# Altium schematic sheet Connectors.SchDoc
size A; SheetNumber: 4; SheetTotal: 4
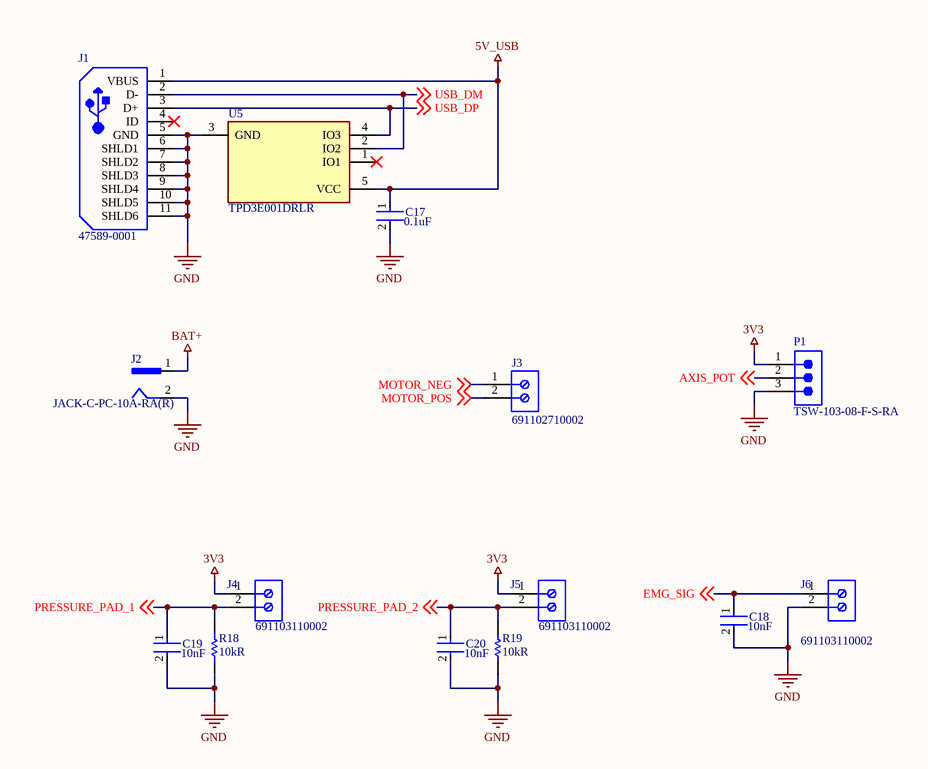
[diagram p0: Connectors.SchDoc]

## Parts
C17  Capacitance: 0.1uF  [FP-GCD21B-0_15-IPC_B]  (hidden comment: GCD21BR71H104MA01L)
C18  Capacitance: 10nF  [FP-C0805C103K8RACAUTO-MFG]  (hidden comment: C0805C103K8RACAUTO)
C19  Capacitance: 10nF  [FP-C0805C103K8RACAUTO-MFG]  (hidden comment: C0805C103K8RACAUTO)
C20  Capacitance: 10nF  [FP-C0805C103K8RACAUTO-MFG]  (hidden comment: C0805C103K8RACAUTO)
J1  47589-0001  [MOLX-47589-0001_V]
J2  JACK-C-PC-10A-RA(R)  [GLOBTECK_JACK-C-PC-10A-RA(R)]
J3  691102710002  [691102710002]
J4  691103110002  [691103110002]
J5  691103110002  [691103110002]
J6  691103110002  [691103110002]
P1  TSW-103-08-F-S-RA  [SMTC-TSW-103-08-X-S-RA]
R18  value 10kR  [RESC2013X60X35NL10T20]  (hidden comment: RC0805FR-0710KL)
R19  value 10kR  [RESC2013X60X35NL10T20]  (hidden comment: RC0805FR-0710KL)
U5  TPD3E001DRLR  [FP-DRL0005A-MFG]

## Nets
3V3: J4.1 J5.1 P1.1
5V_USB: C17.1 J1.1(VBUS) U5.5(VCC)
BAT+: J2.1
GND: C17.2 C18.2 C19.2 C20.2 J1.5(GND) J1.6(SHLD1) J1.7(SHLD2) J1.8(SHLD3) J1.9(SHLD4) J1.10(SHLD5) J1.11(SHLD6) J2.2 J6.2 P1.3 R18.2 R19.2 U5.3(GND)
AXIS_POT: P1.2 ; off-sheet AXIS_POT
EMG_SIG: C18.1 J6.1 ; off-sheet EMG_SIG
MOTOR_NEG: J3.1 ; off-sheet MOTOR_NEG
MOTOR_POS: J3.2 ; off-sheet MOTOR_POS
PRESSURE_PAD_1: C19.1 J4.2 R18.1 ; off-sheet PRESSURE_PAD_1
PRESSURE_PAD_2: C20.1 J5.2 R19.1 ; off-sheet PRESSURE_PAD_2
USB_DM: J1.2(D-) U5.2(IO2) ; off-sheet USB_DM
USB_DP: J1.3(D+) U5.4(IO3) ; off-sheet USB_DP

Not connected (* = marked no-connect by the designer): J1 4(ID)*; U5 1(IO1)*

## Library data of the parts
C17 = CMP-06035-004518-1: Chip Multilayer Ceramic Capacitors for Automotive, 0805, 0.10uF, X7R, 15%, 20%, 50V, Grade 1
C18-C20 = CMP-00212-126448506-1: C0805C103K8RACAUTO Cap, 0.01UF, 10V, Mlcc, 0805 Rohs Compliant: Yes; Material: Ceramic; Dielectric: X7R; Tolerance: 10%; Height: 880µm; NexarPartId: 126448506; Voltage Rating: 10V; Voltage Rating (DC): 10V; Min Operating Temperature: -55°C; Max Operating Temperature: 125°C; Case/Package: 0805; RoHS: Compliant
J1 = CMP-2000-05610-1: Right Angle Female Type AB Micro USB Connector, 30 V, 1.8 A, -30 to 85 degC, RoHS, Tape and Reel; Number of Ports: 1Port; Current Rating: 1.8A; Brand: Molex; Connector Type: MicroUSBTypeABreceptacle; Number of Contacts: 5Contact; Voltage Rating: 30VAC; Color: Black; Product: MicroUSBTypeABConnectors; Package URL: http://www.molex.com/pdm_docs/sd/475890001_sd.pdf; Contact Plating: Gold; Datasheet URL: http://www.molex.com/webdocs/datasheets/pdf/en-us/0475890001_IO_CONNECTORS.pdf; Operating Temperature Range: -20Cto+85C; Termination Style: SMD/SMT; Mounting Angle: Right; Package Reference: 47589-0001; Gender: Female; Package Description: Micro USB Connector, Pitch 0.65 mm, 5 Positions, Body 7.5 x 5.6 mm; Mounting Technology: SurfaceMount; Contact Material: CopperAlloy; Packaging: Reel; RoHS: True; Standard: USB; Manufacturer URL: http://www.molex.com/; Manufacturer: Molex; Datasheet Version: 12/2016; Product Category: USBConnectors; Series: 47589
J2 = JACK-C-PC-10A-RA(R): Power Barrel Connector Jack 2.10mm ID _0.083_, 5.50mm OD _0.217_ Through Hole, Right Angle; MF: GlobTek, Inc.; MP: JACK-C-PC-10A-RA_R_; Value: *; Digi-Key_Purchase_URL: https://www.digikey.com/product-detail/en/globtek-inc/JACK-C-PC-10A-RA_R_/1939-1086-ND/8597889?utm_source=snapeda&utm_medium=aggregator&utm_campaign=symbol; Digi-Key_Part_Number: 1939-1086-ND; Package: None; SnapEDA_Link: https://www.snapeda.com/parts/JACK-C-PC-10A-RA%28R%29/GlobTek%2C%20Inc./view-part/3076017/?ref=snap
J3 = CMP-1502-03258-3: 102 Series 5MM Pitch Straight, Pcb Terminal Block, Through Hole, 2 Way; Current Rating: 15A; Wire/Cable Gauge: 22AWG; Voltage: 300V; Number of Positions Per Level: 2; Plating: Steel; Stripping Length: -6mm; Wire Gauge (Min): 14AWG; Number of Levels: 1; Pitch: 5.0038mm; Width: 11.2mm; Max Operating Temperature: 105°C; Contact Material: Brass; Contact Plating: Tin; Current: 15A; Wire Gauge (Max): 22AWG; Mount: Through Hole; Length: 7.5mm; Min Operating Temperature: -40°C; RoHS: Compliant; Color: Blue; Number of Pins: 2; Housing Material: Nylon; Termination: Screw; Height: 13.4mm; Number of Contacts: 2; Lead Pitch: 5mm; Voltage Rating: 300V; Packaging: Box
J4-J6 = CMP-1502-03254-3: 1031 Series 3.5MM Pitch Straight, Pcb Terminal Block, Through Hole, 2 Way; Pitch: 3.5052mm; Current Rating: 10A; Number of Positions Per Level: 2; Plating: Steel; Number of Levels: 1; Voltage: 125V; Wire/Cable Gauge: 26AWG; Stripping Length: -6mm; Wire Gauge (Min): 16AWG; Packaging: Box; Number of Rows: 1; Color: Blue; Height: 8.5mm; Current: 10A; Lead Pitch: 3.5mm; RoHS: Compliant; Housing Material: Nylon; Width: 8mm; Length: 7mm; Contact Plating: Tin; Number of Pins: 2; Mount: Through Hole; Min Operating Temperature: -40°C; Number of Contacts: 2; Termination: Screw; Wire Gauge (Max): 26AWG; Max Operating Temperature: 105°C; Voltage Rating: 125V; Contact Material: Copper, Nickel, Tin, Zinc
P1 = CMP-1024-00344-1: 0.025" SQ Post Header, Through-hole, Right Angle, -55 to 125 degC, 2.54 mm Pitch, 3-Pin, Male, RoHS; Manufacturer: Samtec; Pitch: 2.54 mm; PackageVersion: DM, 8/1988; ComponentLink3Description: Package Specification; ComponentLink2Description: Datasheet; PackageDescription: .025[0.64] SQ. Post Terminal Strip Assembly; ComponentLink3URL: http://www.samtec.com/documents/webfiles/cpdf/TSW-XXX-XX-XXX-X-XX-XXX-MKT.pdf; ComponentLink1URL: http://www.samtec.com; Mounting Technology: Through-hole; ComponentLink2URL: http://www.samtec.com/documents/webfiles/pdf/TSW_TH.PDF; RoHS: True; Temperature Range: -55 to 125 degC; Orientation: Right Angle; DatasheetVersion: F-214; ComponentLink1Description: Manufacturer URL; PackageReference: TSW-103-08-X-S-RA; PartNumber: TSW-103-08-F-S-RA
R18 R19 = CMP-1659-00013-4: Chip Resistor, 10 KOhm, +/- 1%, 0.125 W, -55 to 155 degC, 0805 (2012 Metric), RoHS, Tape and Reel; Manufacturer: Yageo; Voltage Rating: 150 V; Power: 125mW; Rated Temperature: 70°C; Temperature Coefficient: 100ppm/°C; Additional Feature: LASER TRIMMABLE; Working Voltage: 150V; Package Length: 2mm; Package Height: 0.5mm; Package Width: 1.25mm; Mount: Surface Mount; ComponentLink1Description: Manufacturer URL; ComponentLink2URL: http://www.yageo.com/documents/recent/PYu-RC_Group_51_RoHS_L_04.pdf; Pins: 2; Length: 2 mm; Min Operating Temperature: -55 degC; Height: 0.5 mm; Mounting Technology: Surface Mount; RoHSCompliant: true; REACH SVHC: No SVHC; ComponentLink1URL: http://www.yageo.com/; Max Operating Temperature: 155 degC; PackageReference: 0805; DatasheetVersion: Rev. 4, 02/2016; Package Quantity: 5000; Packaging: Tape and Reel; ComponentLink2Description: Datasheet; PackageDescription: 2-Pin Surface Mounted Device, Body 2 x 1.25 mm; Supplier: Digikey; Supplier Part Number: 311-10.0KCRCT-ND; Manufacturer Part Number: RC0805FR-0710KL; RoHS: Yes; Category: Chip SMD Resistors; Stock: 4430741; Pricing: 1=0.1, 10=0.027, 50=0.017, 100=0.0142, 500=0.00976, 1000=0.00844 (USD); Package Shape: Rectangular; Terminal Finish: Nickel; Case/Package: 0805; Tolerance: 1%; JESD-609 Code: e3; Resistor Type: FIXED RESISTOR; Construction: Chip; Package Style: SMTMeter; Technology: METAL GLAZE/THICK FILM; Termination: Wraparound; Reach SVHC Compliant: Yes; RoHS Compliant: Yes; ComponentLink3URL: https://datasheet.ciiva.com:443/pdfs/VipMasterIC/IC/YAGO/YAGO-S-A0008145938/YAGO-S-A0008145938-1.pdf?src-supplier=IHS+Markit; ComponentLink3Description: https://datasheet.ciiva.com:443/pdfs/VipMasterIC/IC/YAGO/YAGO-S-A0008145938/YAGO-S-A0008145938-1.pdf?src-supplier=IHS+Markit; ComponentLink4URL: https://datasheet.ciiva.com/11808/0900766b8106beab-11808151.pdf?src-supplier=Rs; ComponentLink4Description: https://datasheet.ciiva.com/11808/0900766b8106beab-11808151.pdf?src-supplier=Rs; ComponentLink5URL: https://datasheet.ciiva.com/46447/444164-46447563.pdf?src-supplier=Element14; ComponentLink5Description: https://datasheet.ciiva.com/46447/444164-46447563.pdf?src-supplier=Element14; ComponentLink6URL: https://datasheet.ciiva.com/2456/pyu-r-int-thick-7-2456973.pdf?src-supplier=Digikey; ComponentLink6Description: https://datasheet.ciiva.com/2456/pyu-r-int-thick-7-2456973.pdf?src-supplier=Digikey; ComponentLink7URL: https://datasheet.ciiva.com/2456/pyu-r-int-thick-7-2456974.pdf?src-supplier=Digikey; ComponentLink7Description: https://datasheet.ciiva.com/2456/pyu-r-int-thick-7-2456974.pdf?src-supplier=Digikey; ComponentLink8URL: https://datasheet.ciiva.com/2456/pyu-r-int-thick-7-2456972.pdf?src-supplier=Digikey; ComponentLink8Description: https://datasheet.ciiva.com/2456/pyu-r-int-thick-7-2456972.pdf?src-supplier=Digikey; ComponentLink9URL: https://datasheet.ciiva.com/12669/rc0805-12669688.pdf?src-supplier=Mouser; ComponentLink9Description: https://datasheet.ciiva.com/12669/rc0805-12669688.pdf?src-supplier=Mouser; ComponentLink10URL: https://datasheet.ciiva.com/16747/rc0805-16747087.pdf?src-supplier=Future+Electronics; ComponentLink10Description: https://datasheet.ciiva.com/16747/rc0805-16747087.pdf?src-supplier=Future+Electronics
U5 = CMP-0326-00052-4: TVS DIODE 5.5V SOT5; Min Supply Voltage: 900mV; Number of Bidirectional Channels: 3; Peak Pulse Power: 90W; Direction: Unidirectional; Leakage Current: 1nA; Interface: USB; Max Supply Current: 100nA; Capacitance: 1.5pF; Breakdown Voltage: 11V; Clamping Voltage: 105.5V; Power Line Protection: Yes; Packaging: Tape and Reel; Length: 1.6mm; REACH SVHC: No SVHC; Min Operating Temperature: -40°C; Lead Free: Lead Free; Max Supply Voltage: 5.5V; RoHS Compliant: Yes; Termination: SMD/SMT; Number of Channels: 3; Max Supply Voltage (DC): 5.5V; Weight: 9.9E-05oz; Package Quantity: 1; Reverse Standoff Voltage: 5.5V; Number of Pins: 5; Case/Package: SOT-553; Max Operating Temperature: 85°C; Nominal Supply Current: 1nA; Width: 1.2mm; Min Breakdown Voltage: 11V; Min Supply Voltage (DC): 900mV; Height: 0.55mm; Radiation Hardening: No; Depth: 1.2mm